# Altium schematic sheet System PMU for RK3399.SchDoc
size A4; SheetNumber: 4; SheetTotal: 26
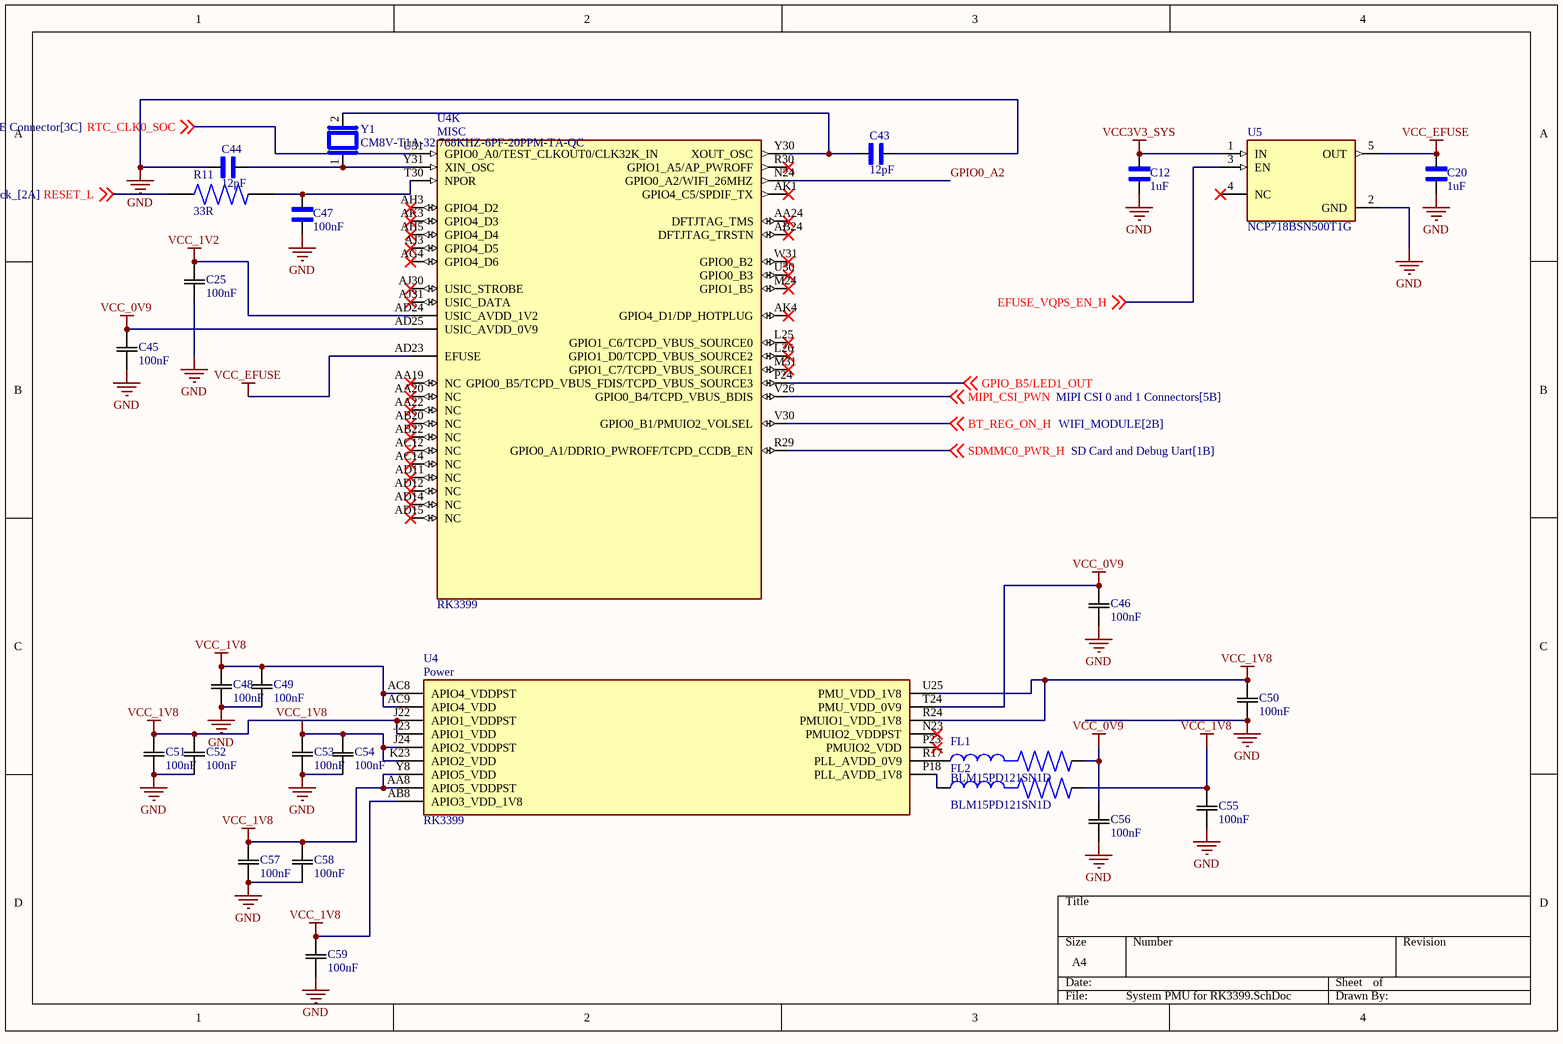
[diagram p0: System PMU for RK3399.SchDoc]

## Parts
C12  1uF  [CAPC1005X56N]
C20  1uF  [CAPC1005X56N]
C25  100nF  [CAP_1005_TDK]
C43  12pF  [CAPC1608X90]
C44  12pF  [CAPC0603X33N]
C45  100nF  [CAP_1005_TDK]
C46  100nF  [CAP_1005_TDK]
C47  100nF  [CAPC2012X90N]
C48  100nF  [CAP_1005_TDK]
C49  100nF  [CAP_1005_TDK]
C50  100nF  [CAP_1005_TDK]
C51  100nF  [CAP_1005_TDK]
C52  100nF  [CAP_1005_TDK]
C53  100nF  [CAP_1005_TDK]
C54  100nF  [CAP_1005_TDK]
C55  100nF  [CAP_1005_TDK]
C56  100nF  [CAP_1005_TDK]
C57  100nF  [CAP_1005_TDK]
C58  100nF  [CAP_1005_TDK]
C59  100nF  [CAP_1005_TDK]
FL1  BLM15PD121SN1D  [BEADC1005X55N]
FL2  BLM15PD121SN1D  [BEADC1005X55N]
R11  33R  [RES_ERA6AHD330V]
U4  RK3399  [BGA828C65P31X31_2100X2100X161N]  (parts K,29 of 32)
U5  NCP718BSN500T1G  [SOT95P280X100-5N]
Y1  CM8V-T1A-32.768KHZ-6PF-20PPM-TA-QC  [XTAL_CM8V-T1A-32.768KHZ-6PF-20PPM-TA-QC]

## Nets
GND: C12.2 C20.2 C25.2 C43.1 C44.1 C45.2 C46.2 C47.2 C48.2 C49.2 C50.2 C51.2 C52.2 C53.2 C54.1 C55.2 C56.2 C57.2 C58.2 C59.2 U5.2(GND)
VCC3V3_SYS: C12.1 U5.1(IN)
VCC_0V9: C45.1 C46.1 C56.1 FL1.2 U4.AD25(USIC_AVDD_0V9) U4.T24(PMU_VDD_0V9)
VCC_1V2: C25.1 U4.AD24(USIC_AVDD_1V2)
VCC_1V8: C48.1 C49.1 C50.1 C51.1 C52.1 C53.1 C54.2 C55.1 C57.1 C58.1 C59.1 FL2.2 U4.AA8(APIO5_VDDPST) U4.AB8(APIO3_VDD_1V8) U4.AC8(APIO4_VDDPST) U4.AC9(APIO4_VDD) U4.J22(APIO1_VDDPST) U4.J23(APIO1_VDD) U4.J24(APIO2_VDDPST) U4.K23(APIO2_VDD) U4.R24(PMUIO1_VDD_1V8) U4.U25(PMU_VDD_1V8) U4.Y8(APIO5_VDD)
VCC_EFUSE: C20.1 U4.AD23(EFUSE) U5.5(OUT)
BT_REG_ON_H: U4.V30(GPIO0_B1/PMUIO2_VOLSEL) ; off-sheet BT_REG_ON_H
EFUSE_VQPS_EN_H: U5.3(EN) ; off-sheet EFUSE_VQPS_EN_H
GPIO0_A2: U4.N24(GPIO0_A2/WIFI_26MHZ)
GPIO_B5/LED1_OUT: U4.P24(GPIO0_B5/TCPD_VBUS_FDIS/TCPD_VBUS_SOURCE3) ; off-sheet GPIO_B5/LED1_OUT
MIPI_CSI_PWN: U4.V26(GPIO0_B4/TCPD_VBUS_BDIS) ; off-sheet MIPI_CSI_PWN
RESET_L: R11.1 ; off-sheet RESET_L
RTC_CLK0_SOC: U4.U31(GPIO0_A0/TEST_CLKOUT0/CLK32K_IN) ; off-sheet RTC_CLK0_SOC
SDMMC0_PWR_H: U4.R29(GPIO0_A1/DDRIO_PWROFF/TCPD_CCDB_EN) ; off-sheet SDMMC0_PWR_H
NetC43_2: C43.2 U4.Y30(XOUT_OSC) Y1.2
NetC44_2: C44.2 U4.Y31(XIN_OSC) Y1.1
NetC47_1: C47.1 R11.2 U4.T30(NPOR)
NetFL1_1: FL1.1 U4.R17(PLL_AVDD_0V9)
NetFL2_1: FL2.1 U4.P18(PLL_AVDD_1V8)

Not connected (* = marked no-connect by the designer): U4 AA19(NC)* AA20(NC)* AA22(NC)* AA24(DFTJTAG_TMS)* AB20(NC)* AB22(NC)* AB24(DFTJTAG_TRSTN)* AC12(NC)* AC14(NC)* AD11(NC)* AD12(NC)* AD14(NC)* AD15(NC)* AG4(GPIO4_D6)* AH3(GPIO4_D2)* AH5(GPIO4_D4)* AJ3(GPIO4_D5)* AJ30(USIC_STROBE)* AJ31(USIC_DATA)* AK1(GPIO4_C5/SPDIF_TX)* AK3(GPIO4_D3)* AK4(GPIO4_D1/DP_HOTPLUG)* L25(GPIO1_C6/TCPD_VBUS_SOURCE0)* L26(GPIO1_D0/TCPD_VBUS_SOURCE2)* M24(GPIO1_B5)* M31(GPIO1_C7/TCPD_VBUS_SOURCE1)* N23(PMUIO2_VDDPST)* P23(PMUIO2_VDD)* R30(GPIO1_A5/AP_PWROFF)* U30(GPIO0_B3)* W31(GPIO0_B2)*; U5 4(NC)*

## Notes on the sheet
- (in symbol RK3399, part K) MISC
- (in symbol RK3399, part 29) Power

## Library data of the parts
C12 C20 = 0402ZD105KAT4A: 1 ÂµF Â±10% 10V Ceramic Capacitor X5R 0402 (1005 Metric); MF: AVX; SnapEDA_Link: https://www.snapeda.com/parts/0402ZD105KAT4A/AVX/view-part/?ref=snap; Package: 1005 AVX; Value: *; MP: 0402ZD105KAT4A; Check_prices: https://www.snapeda.com/parts/0402ZD105KAT4A/AVX/view-part/?ref=eda
C25 C45 C46 C48-C59 = C1005X7R1H104M050BB: Description; Manufacturer_Name: TDK; Copyright: Copyright (C) 2025 Ultra Librarian. All rights reserved.; Manufacturer_Part_Number: C1005X7R1H104M050BB
C43 = 06035J120FBSTR: 12 pF Thin Film Capacitor 50 V 0603 (1608 Metric); MF: AVX; SnapEDA_Link: https://www.snapeda.com/parts/06035J120FBSTR/AVX/view-part/?ref=snap; Package: 0603-2 AVX; Value: *; MP: 06035J120FBSTR; Check_prices: https://www.snapeda.com/parts/06035J120FBSTR/AVX/view-part/?ref=eda
C44 = 02013A120GAT2A: Cap Ceramic 12pF 25V C0G 2% Pad SMD 0201 125Â°C T/R; MF: KYOCERA AVX Components; SnapEDA_Link: https://www.snapeda.com/parts/02013A120GAT2A/Kyocera/view-part/?ref=snap; Package: 0603 AVX; Value: *; MP: 02013A120GAT2A; Check_prices: https://www.snapeda.com/parts/02013A120GAT2A/Kyocera/view-part/?ref=eda
C47 = VJ0805Y104KXXCW1BC: Capacitor: ceramic; MLCC; 100nF; 25V; X7R; Â±10%; SMD; 0805; MF: Vishay Vitramon; SnapEDA_Link: https://www.snapeda.com/parts/VJ0805Y104KXXCW1BC/Vishay/view-part/?ref=snap; Package: 0805-2 VISHAY; Value: *; MP: VJ0805Y104KXXCW1BC; Check_prices: https://www.snapeda.com/parts/VJ0805Y104KXXCW1BC/Vishay/view-part/?ref=eda
FL1 FL2 = BLM15PD121SN1D: 120 Ohms @ 100 MHz 1 Power Line Ferrite Bead 0402 (1005 Metric) 1.3A 90mOhm; MF: Murata; SnapEDA_Link: https://www.snapeda.com/parts/BLM15PD121SN1D/Murata/view-part/?ref=snap; Package: 1005 Taiyo Yuden; Value: *; MP: BLM15PD121SN1D; Check_prices: https://www.snapeda.com/parts/BLM15PD121SN1D/Murata/view-part/?ref=eda
R11 = ERA6AHD330V: Package: None; MP: ERA6AHD330V; Price: None; Value: *; Availability: Unavailable
U4 = RK3399: RK3399 ROCK Pi 4 Model A 2GB - ARMÂ® CortexÂ®-A53, CortexÂ®-A72 MPU Embedded Evaluation Board; MF: Rockchip; SnapEDA_Link: https://www.snapeda.com/parts/RK3399/Fuzhou+Rockchip+Electronics+Co/view-part/?ref=snap; Package: Seeed Technology; MP: RK3399; Check_prices: https://www.snapeda.com/parts/RK3399/Fuzhou+Rockchip+Electronics+Co/view-part/?ref=eda; Price: None; Value: *; Availability: Not in stock
U5 = NCP718BSN500T1G: Linear Voltage Regulator IC Positive Fixed 1 Output 300mA TSOT-23-5; MF: ON Semiconductor; SnapEDA_Link: https://www.snapeda.com/parts/NCP718BSN500T1G/Onsemi/view-part/?ref=snap; Package: TSOT-23-5 ON Semiconductor; Value: *; MP: NCP718BSN500T1G; Check_prices: https://www.snapeda.com/parts/NCP718BSN500T1G/Onsemi/view-part/?ref=eda
Y1 = CM8V-T1A-32.768KHZ-6PF-20PPM-TA-QC: Tuning Fork Crystal 32.768kHz in SMD 1.2 x 2.0mm package; MF: Micro Crystal; SnapEDA_Link: https://www.snapeda.com/parts/CM8V-T1A-32.768kHz-6pF-20PPM-TA-QC/Micro+Crystal/view-part/?ref=snap; Package: SMD-2 Micro Crystal; Value: *; MP: CM8V-T1A-32.768kHz-6pF-20PPM-TA-QC; Check_prices: https://www.snapeda.com/parts/CM8V-T1A-32.768kHz-6pF-20PPM-TA-QC/Micro+Crystal/view-part/?ref=eda